# EasyEDA schematic 1-Schematic_CessnaCitationX_CopilotBoard.json
TITLE: Copilot board; REV: 1.0; Date: 2018-11-17; Sheet: 1/1; Drawn By: F-ORKI
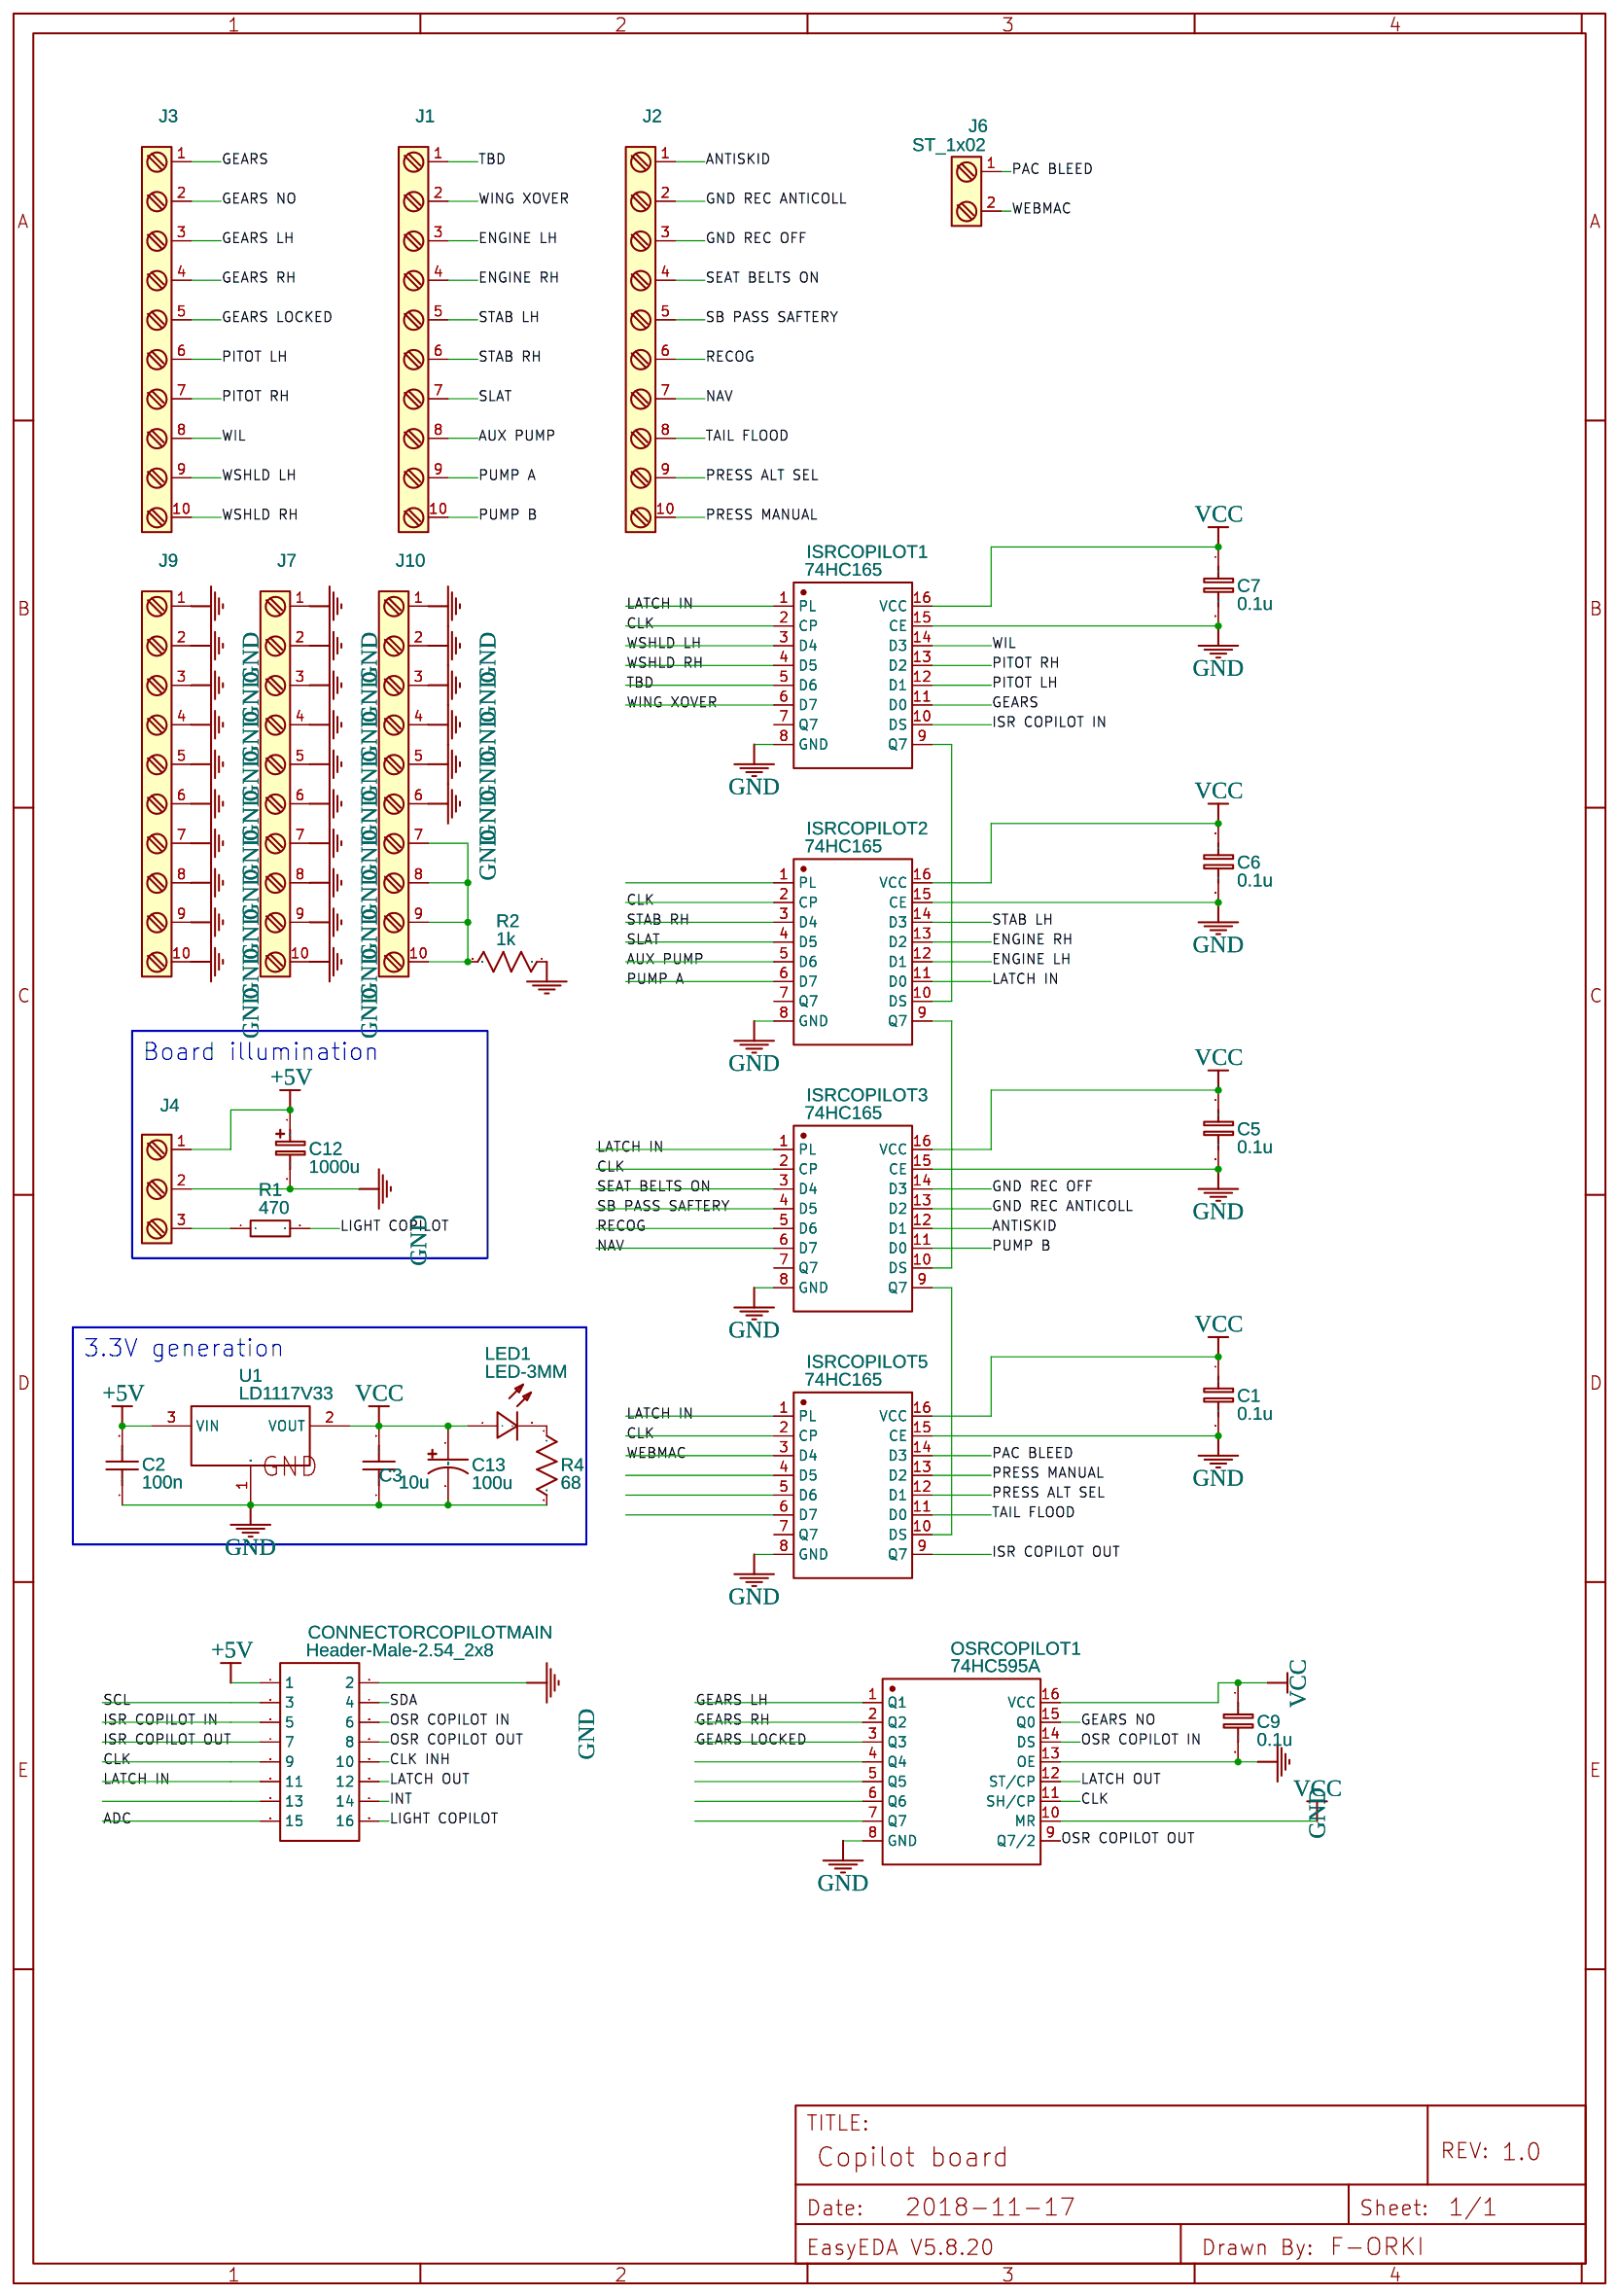
[diagram p0: schematic sheet]

## Parts
C1  0.1u  [RAD-0.1]
C2  100n  [RAD-0.1]
C3  10u  [RAD-0.1]
C5  0.1u  [RAD-0.1]
C6  0.1u  [RAD-0.1]
C7  0.1u  [RAD-0.1]
C9  0.1u  [RAD-0.1]
C12  1000u  [CAP-D3.0XF1.5]
C13  100u  [CAP-D3.0XF1.5]
CONNECTORCOPILOTMAIN  Header-Male-2.54_2x8  [IDC16 2.54 28X8.7 MM]
ISRCOPILOT1  74HC165  [DIP16]
ISRCOPILOT2  74HC165  [DIP16]
ISRCOPILOT3  74HC165  [DIP16]
ISRCOPILOT5  74HC165  [DIP16]
J1  Screw_Terminal_1x10  [TERMINALBLOCK_PHEONIX_MPT-2.54MM_10POL]
J2  Screw_Terminal_1x10  [TERMINALBLOCK_PHEONIX_MPT-2.54MM_10POL]
J3  Screw_Terminal_1x10  [TERMINALBLOCK_PHEONIX_MPT-2.54MM_10POL]
J4  Screw_Terminal_1x03  [TERMINALBLOCK_PHEONIX_MPT-2.54MM_3POL]
J6  ST_1x02  [TERMINALBLOCK_PHEONIX_MPT-2.54MM_2POL]
J7  Screw_Terminal_1x10  [TERMINALBLOCK_PHEONIX_MPT-2.54MM_10POL]
J9  Screw_Terminal_1x10  [TERMINALBLOCK_PHEONIX_MPT-2.54MM_10POL]
J10  Screw_Terminal_1x10  [TERMINALBLOCK_PHEONIX_MPT-2.54MM_10POL]
LED1  LED-3MM  [LED-3MM/2.54]
OSRCOPILOT1  74HC595A  [DIP-16]
R1  470  [AXIAL-0.3]
R2  1k  [AXIAL-0.3]
R4  68  [AXIAL-0.3]
U1  LD1117V33  [TO-220(TO-220-3)]

## Library data of the parts
C1 C5-C7 C9 = Cap_RAD-0.1_EU: Manufacturer Part: ?
C2 C3 = Cap_RAD-0.1_US: Manufacturer Part: ?
C12 = Cap_Electrolytic(TH)_D3.0XF1.5_EU: Contributor: EasyEDA; Manufacturer Part: ?
C13 = Cap_Electrolytic(TH)_D3.0XF1.5_US: Manufacturer Part: ?
CONNECTORCOPILOTMAIN = -: Supplier Part: C68234; Supplier: LCSC; Manufacturer: BOOMELE; Manufacturer Part: Double row straight 2*8Headers  Pins 2.54mm; image: //image.lceda.cn/szlcsc/C68234.jpg
ISRCOPILOT1-ISRCOPILOT3 ISRCOPILOT5 = -: Supplier: LCSC; Manufacturer: Nexperia; Manufacturer Part: 74HC165D,653; LCSC Assembly: Yes; image: //image.lceda.cn/szlcsc/C5613.jpg; Contributor: LCSC; Supplier Part: C5613
J1-J4 J6 J7 J9 J10 = -: Contributor: KiCAD; license: https://www.gnu.org/licenses/lgpl-2.1.html; Manufacturer Part: ?
LED1 = -: Supplier: LCSC; Manufacturer: EVERLIGHT; Manufacturer Part: 204-10SURD/S530-A3; Supplier Part: C99772
OSRCOPILOT1 = -: Supplier: LCSC; Manufacturer: FM; Contributor: LCSC; Supplier Part: C110383
R1 = Res_AXIAL-0.3(1/8W)_EU: Manufacturer Part: ?
R2 R4 = Res_AXIAL-0.3(1/8W)_US: Manufacturer Part: ?
U1 = -: Supplier: LCSC; Supplier Part: C283467; Manufacturer: STMicroelectronics; Contributor: LCSC

## Nets
+5V: C2.2 C12.1 CONNECTORCOPILOTMAIN.1 J4.1 U1.3(VIN)
GND: C1.2 C2.1 C3.1 C5.2 C6.2 C7.2 C9.2 C12.2 C13.2 CONNECTORCOPILOTMAIN.2 ISRCOPILOT1.8(GND) ISRCOPILOT1.15(CE) ISRCOPILOT2.8(GND) ISRCOPILOT2.15(CE) ISRCOPILOT3.8(GND) ISRCOPILOT3.15(CE) ISRCOPILOT5.8(GND) ISRCOPILOT5.15(CE) J4.2 J7.1 J7.2 J7.3 J7.4 J7.5 J7.6 J7.7 J7.8 J7.9 J7.10 J9.1 J9.2 J9.3 J9.4 J9.5 J9.6 J9.7 J9.8 J9.9 J9.10 J10.1 J10.2 J10.3 J10.4 J10.5 J10.6 OSRCOPILOT1.8(GND) OSRCOPILOT1.13(OE) R2.1 R4.2 U1.1(GND)
GND REC ANTICOLL: ISRCOPILOT3.13(D2) J2.2
GND REC OFF: ISRCOPILOT3.14(D3) J2.3
VCC: C1.1 C3.2 C5.1 C6.1 C7.1 C9.1 C13.1 ISRCOPILOT1.16(VCC) ISRCOPILOT2.16(VCC) ISRCOPILOT3.16(VCC) ISRCOPILOT5.16(VCC) LED1.1(+) OSRCOPILOT1.10(MR) OSRCOPILOT1.16(VCC) U1.2(VOUT)
ADC: CONNECTORCOPILOTMAIN.15
ANTISKID: ISRCOPILOT3.12(D1) J2.1
AUX PUMP: ISRCOPILOT2.5(D6) J1.8
CLK: CONNECTORCOPILOTMAIN.9 ISRCOPILOT1.2(CP) ISRCOPILOT2.2(CP) ISRCOPILOT3.2(CP) ISRCOPILOT5.2(CP) OSRCOPILOT1.11(SH/CP)
CLK INH: CONNECTORCOPILOTMAIN.10
ENGINE LH: ISRCOPILOT2.12(D1) J1.3
ENGINE RH: ISRCOPILOT2.13(D2) J1.4
GEARS: ISRCOPILOT1.11(D0) J3.1
GEARS LH: J3.3 OSRCOPILOT1.1(Q1)
GEARS LOCKED: J3.5 OSRCOPILOT1.3(Q3)
GEARS NO: J3.2 OSRCOPILOT1.15(Q0)
GEARS RH: J3.4 OSRCOPILOT1.2(Q2)
INT: CONNECTORCOPILOTMAIN.14
ISR COPILOT IN: CONNECTORCOPILOTMAIN.5 ISRCOPILOT1.10(DS)
ISR COPILOT OUT: CONNECTORCOPILOTMAIN.7 ISRCOPILOT5.9(Q7)
LATCH IN: CONNECTORCOPILOTMAIN.11 ISRCOPILOT1.1(PL) ISRCOPILOT2.11(D0) ISRCOPILOT3.1(PL) ISRCOPILOT5.1(PL)
LATCH OUT: CONNECTORCOPILOTMAIN.12 OSRCOPILOT1.12(ST/CP)
LIGHT COPILOT: CONNECTORCOPILOTMAIN.16 R1.2
NAV: ISRCOPILOT3.6(D7) J2.7
OSR COPILOT IN: CONNECTORCOPILOTMAIN.6 OSRCOPILOT1.14(DS)
OSR COPILOT OUT: CONNECTORCOPILOTMAIN.8 OSRCOPILOT1.9(Q7/2)
PAC BLEED: ISRCOPILOT5.14(D3) J6.1
PITOT LH: ISRCOPILOT1.12(D1) J3.6
PITOT RH: ISRCOPILOT1.13(D2) J3.7
PRESS ALT SEL: ISRCOPILOT5.12(D1) J2.9
PRESS MANUAL: ISRCOPILOT5.13(D2) J2.10
PUMP A: ISRCOPILOT2.6(D7) J1.9
PUMP B: ISRCOPILOT3.11(D0) J1.10
RECOG: ISRCOPILOT3.5(D6) J2.6
SB PASS SAFTERY: ISRCOPILOT3.4(D5) J2.5
SCL: CONNECTORCOPILOTMAIN.3
SDA: CONNECTORCOPILOTMAIN.4
SEAT BELTS ON: ISRCOPILOT3.3(D4) J2.4
SLAT: ISRCOPILOT2.4(D5) J1.7
STAB LH: ISRCOPILOT2.14(D3) J1.5
STAB RH: ISRCOPILOT2.3(D4) J1.6
TAIL FLOOD: ISRCOPILOT5.11(D0) J2.8
TBD: ISRCOPILOT1.5(D6) J1.1
WEBMAC: ISRCOPILOT5.3(D4) J6.2
WIL: ISRCOPILOT1.14(D3) J3.8
WING XOVER: ISRCOPILOT1.6(D7) J1.2
WSHLD LH: ISRCOPILOT1.3(D4) J3.9
WSHLD RH: ISRCOPILOT1.4(D5) J3.10
ISRCOPILOT1_9: ISRCOPILOT1.9(Q7) ISRCOPILOT2.10(DS)
ISRCOPILOT2_9: ISRCOPILOT2.9(Q7) ISRCOPILOT3.10(DS)
ISRCOPILOT3_9: ISRCOPILOT3.9(Q7) ISRCOPILOT5.10(DS)
J4_3: J4.3 R1.1
J10_7: J10.7 J10.8 J10.9 J10.10 R2.2
R4_1: LED1.2(-) R4.1

Not connected (* = marked no-connect by the designer): CONNECTORCOPILOTMAIN 13; ISRCOPILOT1 7(Q7); ISRCOPILOT2 1(PL) 7(Q7); ISRCOPILOT3 7(Q7); ISRCOPILOT5 4(D5) 5(D6) 6(D7) 7(Q7); OSRCOPILOT1 4(Q4) 5(Q5) 6(Q6) 7(Q7)

## Notes on the sheet
- Board illumination
- 3.3V generation
